# EAGLE schematic MCB-K64F-v1.0.0 (EAGLE 7.7.0)

## Sheet 1 of 3
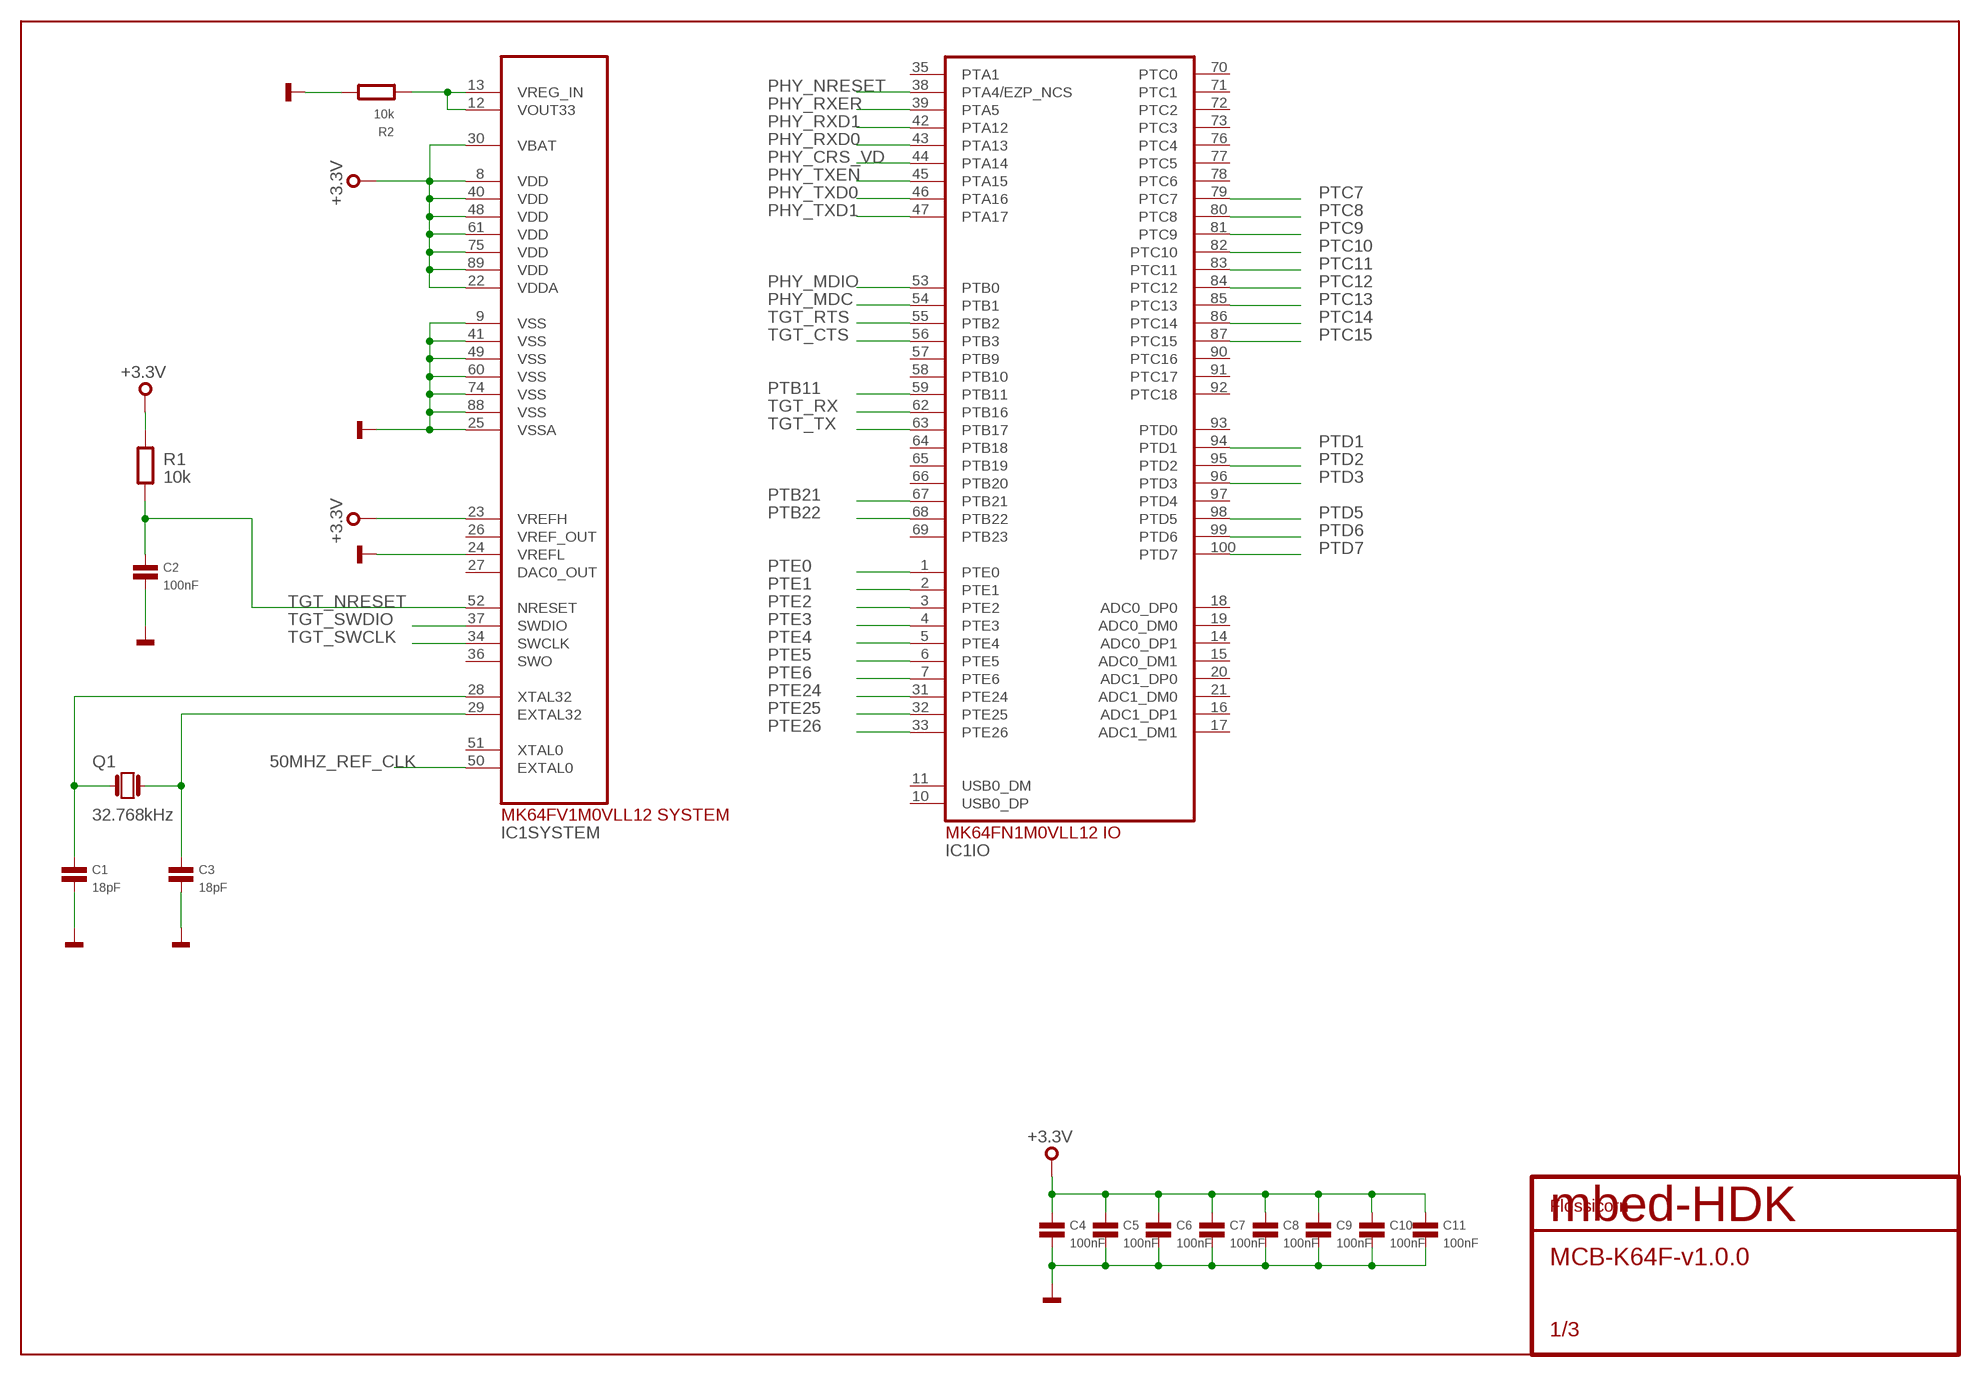
[diagram p0: schematic, sheet 1]

### Parts
C1  18pF  C0603  [0603]
C2  100nF  C0603  [0603]
C3  18pF  C0603  [0603]
C4  100nF  C0603  [0603]
C5  100nF  C0603  [0603]
C6  100nF  C0603  [0603]
C7  100nF  C0603  [0603]
C8  100nF  C0603  [0603]
C9  100nF  C0603  [0603]
C10  100nF  C0603  [0603]
C11  100nF  C0603  [0603]
IC1  MK64FN1M0VLL12  [LQFP100]
Q1  32.768kHz  Q_FC135  [FC135]
R1  10k  R0603  [0603]
R2  10k  R0603  [0603]
SS1  FLOSSICORN0.5  [FLOSSICORN-0.5]

### Nets
50MHZ_REF_CLK: IC1.50(SYSTEM:EXTAL0) ; also sheet 2
+3.3V: C4.1 C5.1 C6.1 C7.1 C8.1 C9.1 C10.1 C11.1 IC1.8(SYSTEM:VDD) IC1.22(SYSTEM:VDDA) IC1.23(SYSTEM:VREFH) IC1.30(SYSTEM:VBAT) IC1.40(SYSTEM:VDD) IC1.48(SYSTEM:VDD) IC1.61(SYSTEM:VDD) IC1.75(SYSTEM:VDD) IC1.89(SYSTEM:VDD) R1.2 ; also sheet 2,3
GND: C1.2 C2.2 C3.2 C4.2 C5.2 C6.2 C7.2 C8.2 C9.2 C10.2 C11.2 IC1.9(SYSTEM:VSS) IC1.24(SYSTEM:VREFL) IC1.25(SYSTEM:VSSA) IC1.41(SYSTEM:VSS) IC1.49(SYSTEM:VSS) IC1.60(SYSTEM:VSS) IC1.74(SYSTEM:VSS) IC1.88(SYSTEM:VSS) R2.2 ; also sheet 2,3
N$2: C1.1 IC1.28(SYSTEM:XTAL32) Q1.X1
N$3: C3.1 IC1.29(SYSTEM:EXTAL32) Q1.X2
N$6: IC1.12(SYSTEM:VOUT33) IC1.13(SYSTEM:VREG_IN) R2.1
PHY_CRS_VD: IC1.44(IO:PTA14) ; also sheet 2
PHY_MDC: IC1.54(IO:PTB1) ; also sheet 2
PHY_MDIO: IC1.53(IO:PTB0) ; also sheet 2
PHY_NRESET: IC1.38(IO:PTA4/EZP_NCS) ; also sheet 2
PHY_RXD0: IC1.43(IO:PTA13) ; also sheet 2
PHY_RXD1: IC1.42(IO:PTA12) ; also sheet 2
PHY_RXER: IC1.39(IO:PTA5) ; also sheet 2
PHY_TXD0: IC1.46(IO:PTA16) ; also sheet 2
PHY_TXD1: IC1.47(IO:PTA17) ; also sheet 2
PHY_TXEN: IC1.45(IO:PTA15) ; also sheet 2
PTB11: IC1.59(IO:PTB11) ; also sheet 3
PTB21: IC1.67(IO:PTB21) ; also sheet 3
PTB22: IC1.68(IO:PTB22) ; also sheet 3
PTC7: IC1.79(IO:PTC7) ; also sheet 3
PTC8: IC1.80(IO:PTC8) ; also sheet 3
PTC9: IC1.81(IO:PTC9) ; also sheet 3
PTC10: IC1.82(IO:PTC10) ; also sheet 3
PTC11: IC1.83(IO:PTC11) ; also sheet 3
PTC12: IC1.84(IO:PTC12) ; also sheet 3
PTC13: IC1.85(IO:PTC13) ; also sheet 3
PTC14: IC1.86(IO:PTC14) ; also sheet 3
PTC15: IC1.87(IO:PTC15) ; also sheet 3
PTD1: IC1.94(IO:PTD1) ; also sheet 3
PTD2: IC1.95(IO:PTD2) ; also sheet 3
PTD3: IC1.96(IO:PTD3) ; also sheet 3
PTD5: IC1.98(IO:PTD5) ; also sheet 3
PTD6: IC1.99(IO:PTD6) ; also sheet 3
PTD7: IC1.100(IO:PTD7) ; also sheet 3
PTE0: IC1.1(IO:PTE0) ; also sheet 3
PTE1: IC1.2(IO:PTE1) ; also sheet 3
PTE2: IC1.3(IO:PTE2) ; also sheet 3
PTE3: IC1.4(IO:PTE3) ; also sheet 3
PTE4: IC1.5(IO:PTE4) ; also sheet 3
PTE5: IC1.6(IO:PTE5) ; also sheet 3
PTE6: IC1.7(IO:PTE6) ; also sheet 3
PTE24: IC1.31(IO:PTE24) ; also sheet 3
PTE25: IC1.32(IO:PTE25) ; also sheet 3
PTE26: IC1.33(IO:PTE26) ; also sheet 3
TGT_CTS: IC1.56(IO:PTB3) ; also sheet 3
TGT_NRESET: C2.1 IC1.52(SYSTEM:NRESET) R1.1 ; also sheet 3
TGT_RTS: IC1.55(IO:PTB2) ; also sheet 3
TGT_RX: IC1.62(IO:PTB16) ; also sheet 3
TGT_SWCLK: IC1.34(SYSTEM:SWCLK) ; also sheet 3
TGT_SWDIO: IC1.37(SYSTEM:SWDIO) ; also sheet 3
TGT_TX: IC1.63(IO:PTB17) ; also sheet 3
Unconnected: IC1.10(IO:USB0_DP) IC1.11(IO:USB0_DM) IC1.14(IO:ADC0_DP1) IC1.15(IO:ADC0_DM1) IC1.16(IO:ADC1_DP1) IC1.17(IO:ADC1_DM1) IC1.18(IO:ADC0_DP0) IC1.19(IO:ADC0_DM0) IC1.20(IO:ADC1_DP0) IC1.21(IO:ADC1_DM0) IC1.26(SYSTEM:VREF_OUT) IC1.27(SYSTEM:DAC0_OUT) IC1.35(IO:PTA1) IC1.36(SYSTEM:SWO) IC1.51(SYSTEM:XTAL0) IC1.57(IO:PTB9) IC1.58(IO:PTB10) IC1.64(IO:PTB18) IC1.65(IO:PTB19) IC1.66(IO:PTB20) IC1.69(IO:PTB23) IC1.70(IO:PTC0) IC1.71(IO:PTC1) IC1.72(IO:PTC2) IC1.73(IO:PTC3) IC1.76(IO:PTC4) IC1.77(IO:PTC5) IC1.78(IO:PTC6) IC1.90(IO:PTC16) IC1.91(IO:PTC17) IC1.92(IO:PTC18) IC1.93(IO:PTD0) IC1.97(IO:PTD4)

## Sheet 2 of 3
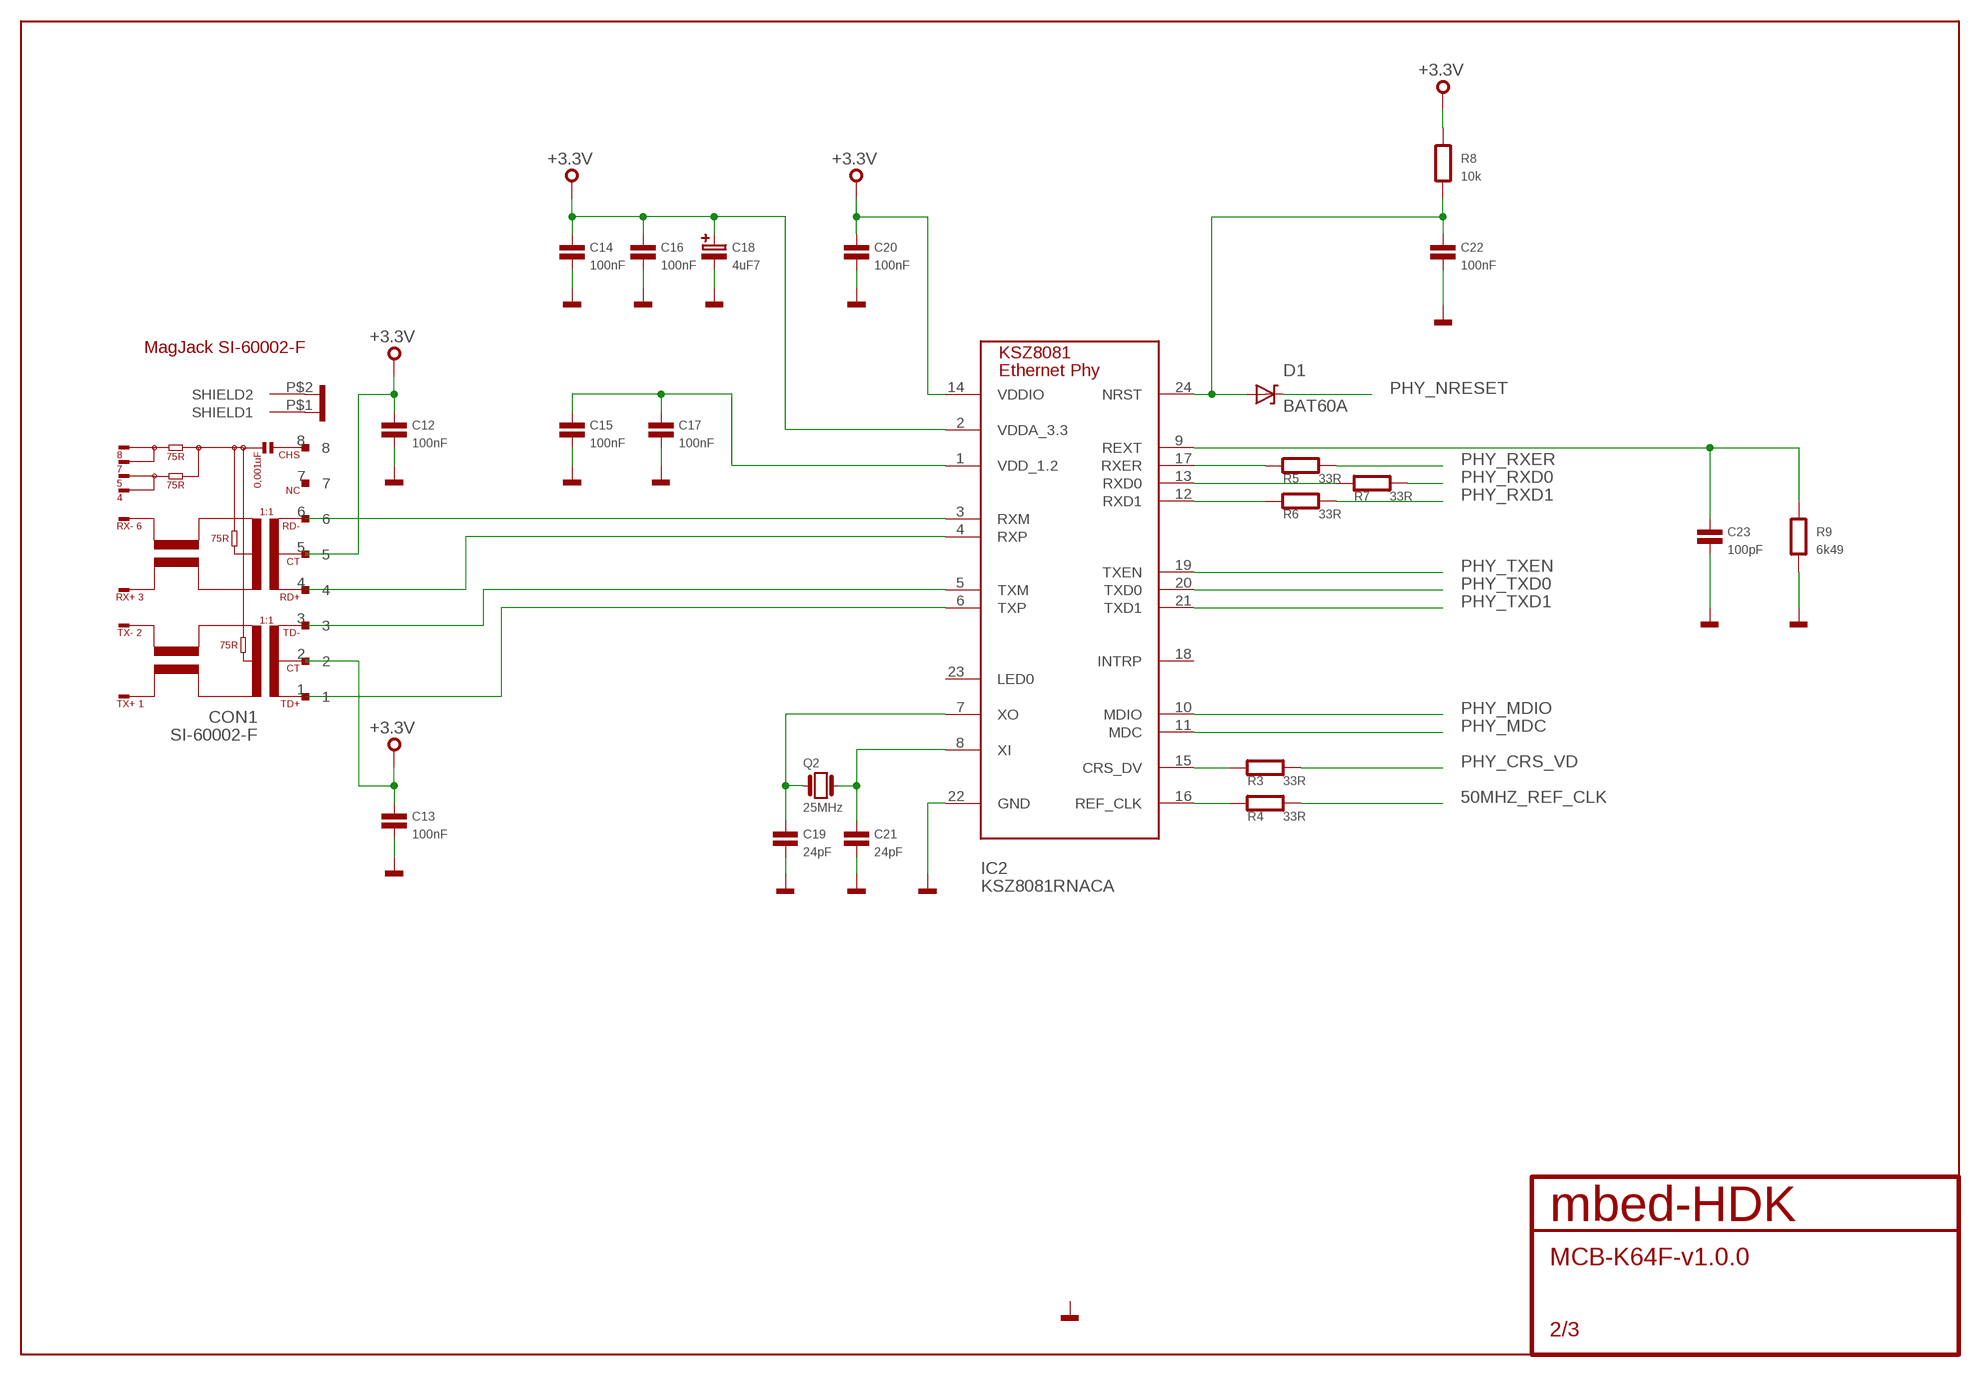
[diagram p1: schematic, sheet 2]

### Parts
C12  100nF  C0603  [0603]
C13  100nF  C0603  [0603]
C14  100nF  C0603  [0603]
C15  100nF  C0603  [0603]
C16  100nF  C0603  [0603]
C17  100nF  C0603  [0603]
C18  4uF7  C-POLA  [SMC_A]
C19  24pF  C0603  [0603]
C20  100nF  C0603  [0603]
C21  24pF  C0603  [0603]
C22  100nF  C0603  [0603]
C23  100pF  C0603  [0603]
CON1  SI-60002-F  [RJ45]
D1  BAT60A  [BAT60A]
IC2  KSZ8081RNACA  [QFN-24]
Q2  25MHz  Q_3.2X2.5  [3.2X.2.5]
R3  33R  R0603  [0603]
R4  33R  R0603  [0603]
R5  33R  R0603  [0603]
R6  33R  R0603  [0603]
R7  33R  R0603  [0603]
R8  10k  R0603  [0603]
R9  6k49  R0603  [0603]

### Nets
50MHZ_REF_CLK: R4.2 ; also sheet 1
+3.3V: C12.1 C13.1 C14.1 C16.1 C18.+ C20.1 CON1.2 CON1.5 IC2.2(VDDA_3.3) IC2.14(VDDIO) R8.2 ; also sheet 1,3
GND: C12.2 C13.2 C14.2 C15.2 C16.2 C17.2 C18.- C19.2 C20.2 C21.2 C22.2 C23.2 CON1.P$1(SHIELD1) CON1.P$2(SHIELD2) IC2.22(GND) R9.1 ; also sheet 1,3
N$17: IC2.16(REF_CLK) R4.1
N$25: CON1.6 IC2.3(RXM)
N$26: CON1.4 IC2.4(RXP)
N$27: CON1.3 IC2.5(TXM)
N$28: CON1.1 IC2.6(TXP)
N$29: C19.1 IC2.7(XO) Q2.P$1
N$30: C21.1 IC2.8(XI) Q2.P$3
N$31: IC2.12(RXD1) R6.1
N$32: IC2.13(RXD0) R7.1
N$33: IC2.17(RXER) R5.1
N$42: IC2.15(CRS_DV) R3.1
N$43: C22.1 D1.A IC2.24(NRST) R8.1
N$44: C15.1 C17.1 IC2.1(VDD_1.2)
N$45: C23.1 IC2.9(REXT) R9.2
PHY_CRS_VD: R3.2 ; also sheet 1
PHY_MDC: IC2.11(MDC) ; also sheet 1
PHY_MDIO: IC2.10(MDIO) ; also sheet 1
PHY_NRESET: D1.K ; also sheet 1
PHY_RXD0: R7.2 ; also sheet 1
PHY_RXD1: R6.2 ; also sheet 1
PHY_RXER: R5.2 ; also sheet 1
PHY_TXD0: IC2.20(TXD0) ; also sheet 1
PHY_TXD1: IC2.21(TXD1) ; also sheet 1
PHY_TXEN: IC2.19(TXEN) ; also sheet 1
Unconnected: CON1.7 CON1.8 IC2.18(INTRP) IC2.23(LED0)

## Sheet 3 of 3
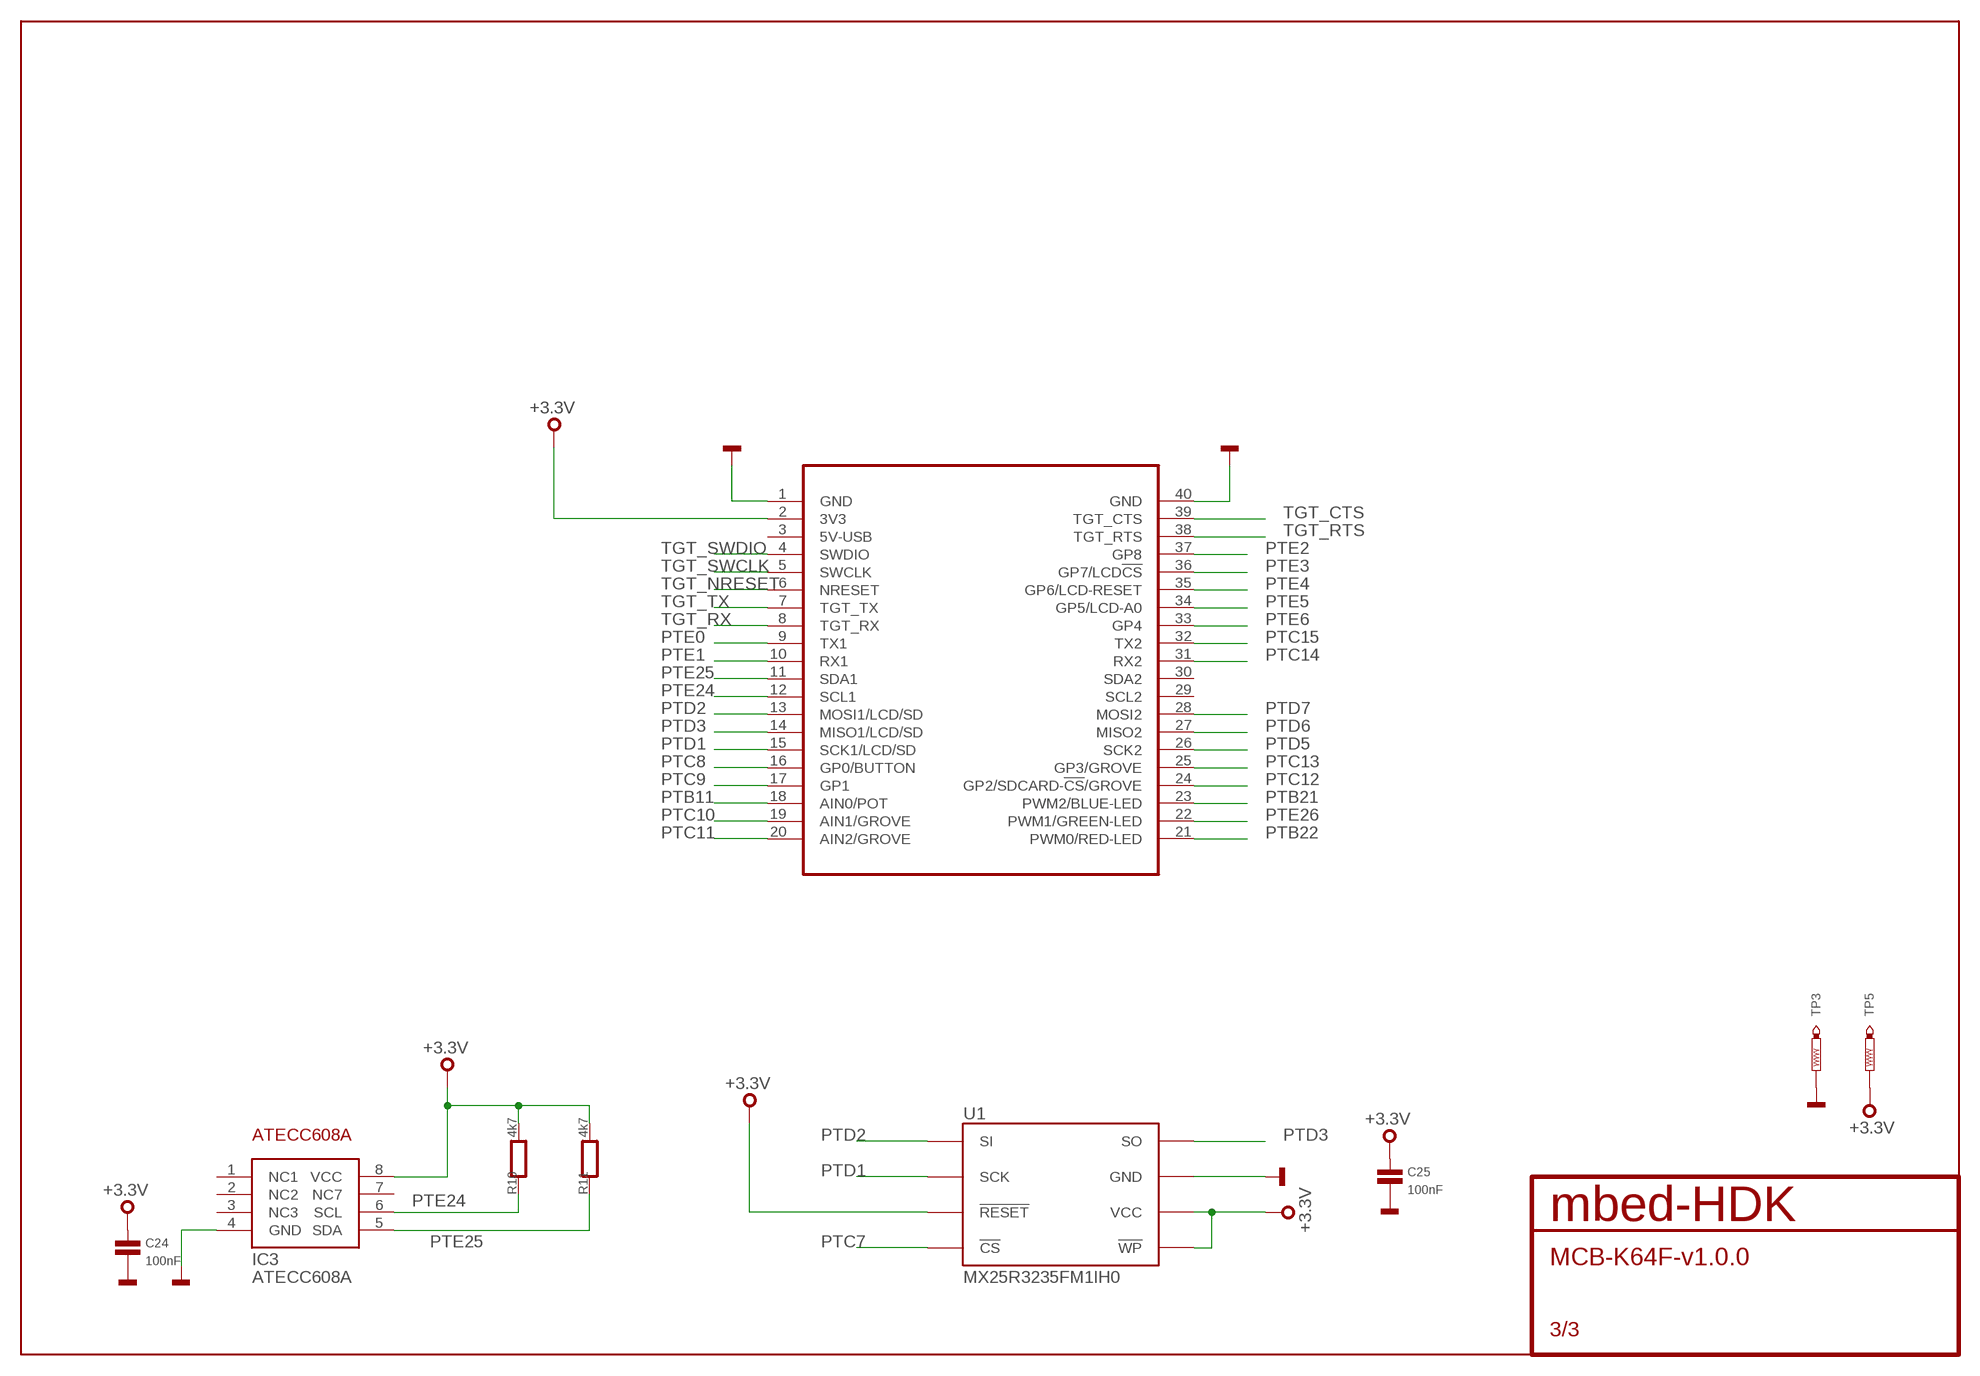
[diagram p2: schematic, sheet 3]

### Parts
C24  100nF  CAPACITOR0603  [0603]
C25  100nF  CAPACITOR0603  [0603]
IC3  ATECC608A  [SO8]
MOD1  MODULE_DAUGHTER  [MODULE_DAUGHTER]
R10  4k7  RESISTOR0603  [0603]
R11  4k7  RESISTOR0603  [0603]
TP3  TEST-POINT-50R-PTH  [TP50-PTH]
TP5  TEST-POINT-50R-PTH  [TP50-PTH]
U1  MX25R3235FM1IH0  [SO8]

### Nets
+3.3V: C24.1 C25.1 IC3.8(VCC) MOD1.2(3V3) R10.2 R11.2 TP5.TP U1.3(!WP) U1.7(!RESET) U1.8(VCC) ; also sheet 1,2
GND: C24.2 C25.2 IC3.4(GND) MOD1.1(GND) MOD1.40(GND) TP3.TP U1.4(GND) ; also sheet 1,2
PTB11: MOD1.18(AIN0/POT) ; also sheet 1
PTB21: MOD1.23(PWM2/BLUE-LED) ; also sheet 1
PTB22: MOD1.21(PWM0/RED-LED) ; also sheet 1
PTC7: U1.1(!CS) ; also sheet 1
PTC8: MOD1.16(GP0/BUTTON) ; also sheet 1
PTC9: MOD1.17(GP1) ; also sheet 1
PTC10: MOD1.19(AIN1/GROVE) ; also sheet 1
PTC11: MOD1.20(AIN2/GROVE) ; also sheet 1
PTC12: MOD1.24(GP2/SDCARD-!CS!/GROVE) ; also sheet 1
PTC13: MOD1.25(GP3/GROVE) ; also sheet 1
PTC14: MOD1.31(RX2) ; also sheet 1
PTC15: MOD1.32(TX2) ; also sheet 1
PTD1: MOD1.15(SCK1/LCD/SD) U1.6(SCK) ; also sheet 1
PTD2: MOD1.13(MOSI1/LCD/SD) U1.5(SI) ; also sheet 1
PTD3: MOD1.14(MISO1/LCD/SD) U1.2(SO) ; also sheet 1
PTD5: MOD1.26(SCK2) ; also sheet 1
PTD6: MOD1.27(MISO2) ; also sheet 1
PTD7: MOD1.28(MOSI2) ; also sheet 1
PTE0: MOD1.9(TX1) ; also sheet 1
PTE1: MOD1.10(RX1) ; also sheet 1
PTE2: MOD1.37(GP8) ; also sheet 1
PTE3: MOD1.36(GP7/LCD!CS) ; also sheet 1
PTE4: MOD1.35(GP6/LCD-RESET) ; also sheet 1
PTE5: MOD1.34(GP5/LCD-A0) ; also sheet 1
PTE6: MOD1.33(GP4) ; also sheet 1
PTE24: IC3.6(SCL) MOD1.12(SCL1) R10.1 ; also sheet 1
PTE25: IC3.5(SDA) MOD1.11(SDA1) R11.1 ; also sheet 1
PTE26: MOD1.22(PWM1/GREEN-LED) ; also sheet 1
TGT_CTS: MOD1.39(TGT_CTS) ; also sheet 1
TGT_NRESET: MOD1.6(NRESET) ; also sheet 1
TGT_RTS: MOD1.38(TGT_RTS) ; also sheet 1
TGT_RX: MOD1.8(TGT_RX) ; also sheet 1
TGT_SWCLK: MOD1.5(SWCLK) ; also sheet 1
TGT_SWDIO: MOD1.4(SWDIO) ; also sheet 1
TGT_TX: MOD1.7(TGT_TX) ; also sheet 1
Unconnected: IC3.1(NC1) IC3.2(NC2) IC3.3(NC3) IC3.7(NC7) MOD1.3(5V-USB) MOD1.29(SCL2) MOD1.30(SDA2)

## Library data of the parts
C1-C17 C19-C23 = mbed-HDK:C: Capacitor
C18 = mbed-HDK:C-POL: Polarised capacitor
C24 C25 = mbed-HDK-RLC:CAPACITOR: Capacitor
CON1 = mbed-HDK-Connector:SI-60002-F: RJ45 Right Angle; MF: Stewart Connector; MFN: SI-60002-F; OC-DIGIKEY: 380-1105-ND; OC-NEWARK: 24M7449
D1 = mbed-HDK:BAT60A: Schottky Diode
IC1 = mbed-HDK:MK64FN1M0VLL12
IC2 = mbed-HDK:KSZ8081
IC3 = blackbriar:ATECC608A
MOD1 = blackbriar:MODULE_DAUGHTER
Q1 Q2 = mbed-HDK:Q
R1-R9 = mbed-HDK:R
R10 R11 = mbed-HDK-RLC:RESISTOR: Resistor
SS1 = blackbriar:FLOSSICORN
TP3 TP5 = mbed-HDK:TEST-POINT
U1 = blackbriar:MX25R3235FM1IH0: Serial Flash 32 Mb 80 Mhz; MF: Macronix; MFN: MX25R3235FM2IH0; OC-DIGIKEY: 1092-1174-ND